# EAGLE schematic simulador (EAGLE 9.6.2)
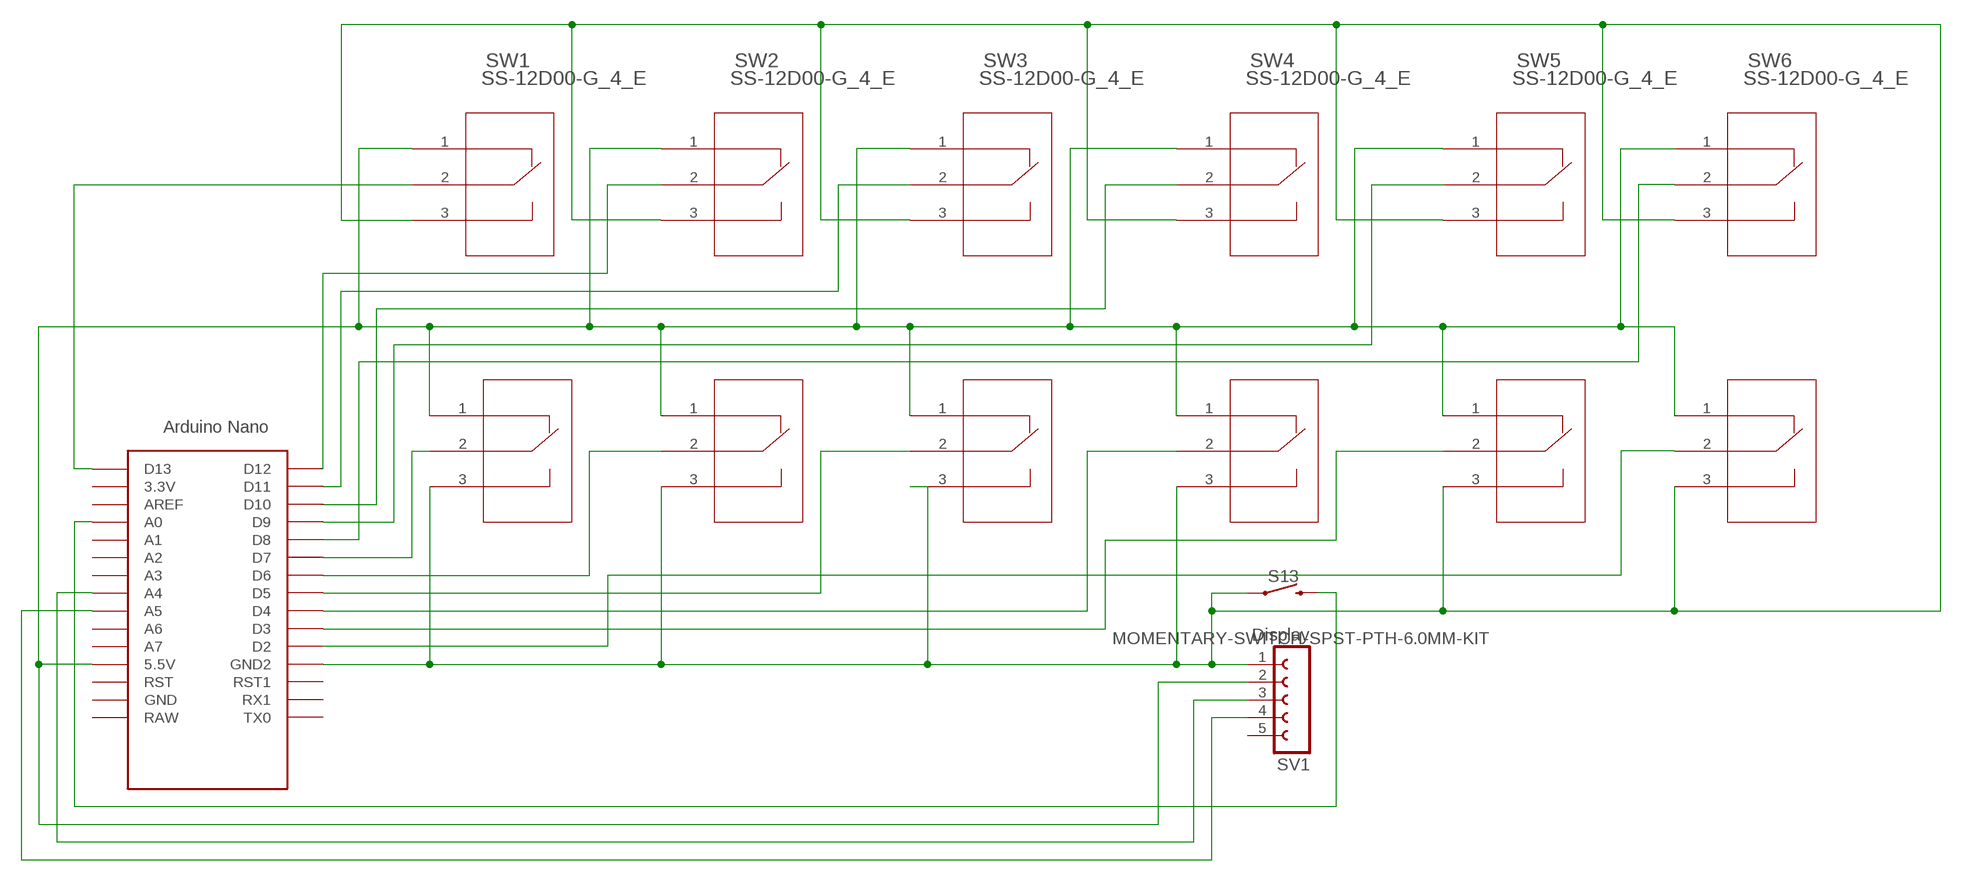
[diagram p0: schematic, sheet 1]

## Parts
S13  MOMENTARY-SWITCH-SPST-PTH-6.0MM-KIT  [TACTILE_SWITCH_PTH_6.0MM_KIT]
SV1  Display  FE05-1  [FE05-1]
SW1  SS-12D00-G_4_E  [1P2T_SS-12D00_CNK]
SW2  SS-12D00-G_4_E  [1P2T_SS-12D00_CNK]
SW3  SS-12D00-G_4_E  [1P2T_SS-12D00_CNK]
SW4  SS-12D00-G_4_E  [1P2T_SS-12D00_CNK]
SW5  SS-12D00-G_4_E  [1P2T_SS-12D00_CNK]
SW6  SS-12D00-G_4_E  [1P2T_SS-12D00_CNK]
SW7  SS-12D00-G_4_E  [1P2T_SS-12D00_CNK]
SW8  SS-12D00-G_4_E  [1P2T_SS-12D00_CNK]
SW9  SS-12D00-G_4_E  [1P2T_SS-12D00_CNK]
SW10  SS-12D00-G_4_E  [1P2T_SS-12D00_CNK]
SW11  SS-12D00-G_4_E  [1P2T_SS-12D00_CNK]
SW12  SS-12D00-G_4_E  [1P2T_SS-12D00_CNK]
U$1  NANO  [NANO]

## Nets
N$1: SV1.2 SW1.1 SW2.1 SW3.1 SW4.1 SW5.1 SW6.1 SW7.1 SW8.1 SW9.1 SW10.1 SW11.1 SW12.1 U$1.5V(5.5V)
N$2: S13.3 U$1.A0
N$3: SV1.3 U$1.A4
N$4: SV1.4 U$1.A5
N$5: S13.1 SV1.1 SW1.3 SW2.3 SW3.3 SW4.3 SW5.3 SW6.3 SW7.3 SW8.3 SW9.3 SW10.3 SW11.3 SW12.3 U$1.GND1(GND2)
N$6: SW1.2 U$1.D13
N$7: SW2.2 U$1.D12
N$8: SW3.2 U$1.D11
N$9: SW7.2 U$1.D7
N$10: SW4.2 U$1.D10
N$11: SW5.2 U$1.D9
N$12: SW6.2 U$1.D8
N$13: SW8.2 U$1.D6
N$14: SW9.2 U$1.D5
N$15: SW10.2 U$1.D4
N$16: SW11.2 U$1.D3
N$17: SW12.2 U$1.D2
Unconnected: SV1.5 U$1.3.3V U$1.A1 U$1.A2 U$1.A3 U$1.A6 U$1.A7 U$1.AREF U$1.GND U$1.ICSP1 U$1.ICSP2 U$1.ICSP3 U$1.ICSP4 U$1.ICSP5 U$1.ICSP6 U$1.RAW U$1.RST U$1.RST1 U$1.RX1 U$1.TX0

## Library data of the parts
S13 = SparkFun-Switches:MOMENTARY-SWITCH-SPST: Momentary Switch (Pushbutton) - SPST Normally-open (NO) SPST momentary switches (buttons, pushbuttons). Variants PTH-12MM - 12mm square, through-hole Momentary Pushbutton Switch - 12mm Square <https://www.sparkfun.com/products/9190> (COM-09190) PTH-6.0MM, PTH-6.0MM-KIT - 6.0mm square, through-hole Mini Pushbutton Switch <https://www.sparkfun.com/products/97> (COM-00097) KIT package intended for soldering kit's - only one side of pads' copper is exposed. PTH-RIGHT-ANGLE-KIT - Right-angle, through-hole Right Angle Tactile Button <https://www.sparkfun.com/products/10791> - Used on SparkFun BigTime Watch Kit <https://www.sparkfun.com/products/11734> SMD-12MM - 12mm square, surface-mount Tactile Button - SMD (12mm) <https://www.sparkfun.com/products/12993> (COM-12993) Used on SparkFun PicoBoard <https://www.sparkfun.com/products/11888> SMD-4.5MM - 4.5mm Square Trackball Switch Used on SparkFun Blackberry Trackballer Breakout <https://www.sparkfun.com/products/13169> SMD-4.6MMX2.8MM - 4.60mm x 2.80mm, surface mount Used on SparkFun Pro Micro - RP2040 <https://www.sparkfun.com/products/17717> SMD-5.2MM, SMD-5.2-REDUNDANT - 5.2mm square, surface-mount Mini Pushbutton Switch - SMD <https://www.sparkfun.com/products/8720> (COM-08720) Used on Arduino Pro Mini <https://www.sparkfun.com/products/11114> REDUNDANT package connects both switch circuits together SMD-6.0X3.5MM - 6.0 x 3.5mm, surface mount Momentary Reset Switch SMD <https://www.sparkfun.com/products/8229> (COM-08229) SMD-6.2MM-TALL - 6.2mm square, surface mount Tactile Button - SMD (6mm) <https://www.sparkfun.com/products/12992> Used on SparkFun Digital Sandbox <https://www.sparkfun.com/products/12651> SMD-RIGHT-ANGLE - Right-angle, surface mount Used on SparkFun Block for Intel® Edison - Arduino <https://www.sparkfun.com/products/13036>; PROD_ID: SWCH-08441; SF_SKU: COM-00097
SV1 = con-lsta:FE05-1: FEMALE HEADER; OC_FARNELL: unknown; OC_NEWARK: unknown
SW1-SW12 = untitled:SS-12D00-G_4_E; COPYRIGHT: Copyright (C) 2025 Ultra Librarian. All rights reserved.; MANUFACTURER_PART_NUMBER: SS-12D00-G 4 E; MFR_NAME: C&K Components; TYPE: Slide Switches
U$1 = Arduino-clone:NANO: Arduino Nano